# Altium schematic sheet WATCHDOG.SchDoc
size 420 x 297 mm; DocumentNumber: 13; SheetNumber: 14; SheetTotal: 17
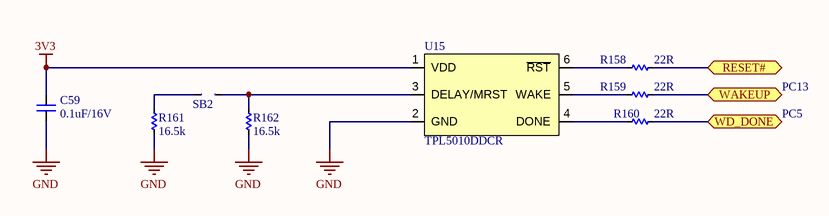
[diagram p0: WATCHDOG.SchDoc]

## Parts
C59  0.1uF/16V  [CAP_C_1608X80]
R158  22R  [RES_C_1608X60]
R159  22R  [RES_C_1608X60]
R160  22R  [RES_C_1608X60]
R161  16.5k  [RES_C_1608X60]
R162  16.5k  [RES_C_1608X60]
SB2  JUMPER  [JUMPER_1608]  (value not drawn)
U15  TPL5010DDCR  [TPL5010DDCR]

## Ports
RESET# (bidir), WAKEUP (bidir), WD_DONE (bidir)

## Nets
3V3: C59.2 U15.1(VDD)
GND: C59.1 R161.1 R162.1 U15.2(GND)
RESET#: R158.2 ; port RESET#
WAKEUP: R159.2 ; port WAKEUP
WD_DONE: R160.2 ; port WD_DONE
NetR158_1: R158.1 U15.6(~{RST})
NetR159_1: R159.1 U15.5(WAKE)
NetR160_1: R160.1 U15.4(DONE)
NetR161_2: R161.2 SB2.1
NetR162_2: R162.2 SB2.2 U15.3(DELAY/MRST)

## Notes on the sheet
- PC13
- PC5
- Project:
- BEE-PC1
- Sub-system:
- NANORACK_EXP_CONTROLLER
- Design by:
- SANG HUYNH
- BAO BUI Q.
- Sheet title:
- Sheet
- A3
- of
- Checked by:
- Approved by:
- VU PHAM
- Revision:
- Document No:
- V1.2.2
- Size:
- Date:

## Library data of the parts
C59 = CAP_SMD: CAP_Chip; Value: 33pF
R158-R162 = _RES_B_2: RES
U15 = TPL5010DDCR: OSC PROG TIMER TSOT23-6